# EasyEDA Pro project Tag.epro

# Schematic Schematic3
Board Name: TAG; Create Date: 2025-11-07; Page Name: P1; Project Name: Sansonev2; Schematic Name: Schematic3; Update Date: 2025-11-14; Company: EasyEDA.com; Drawn: Maximo Huykman; Page Size: A4; Reviewed: Maximo Huykman; Version: V1.0
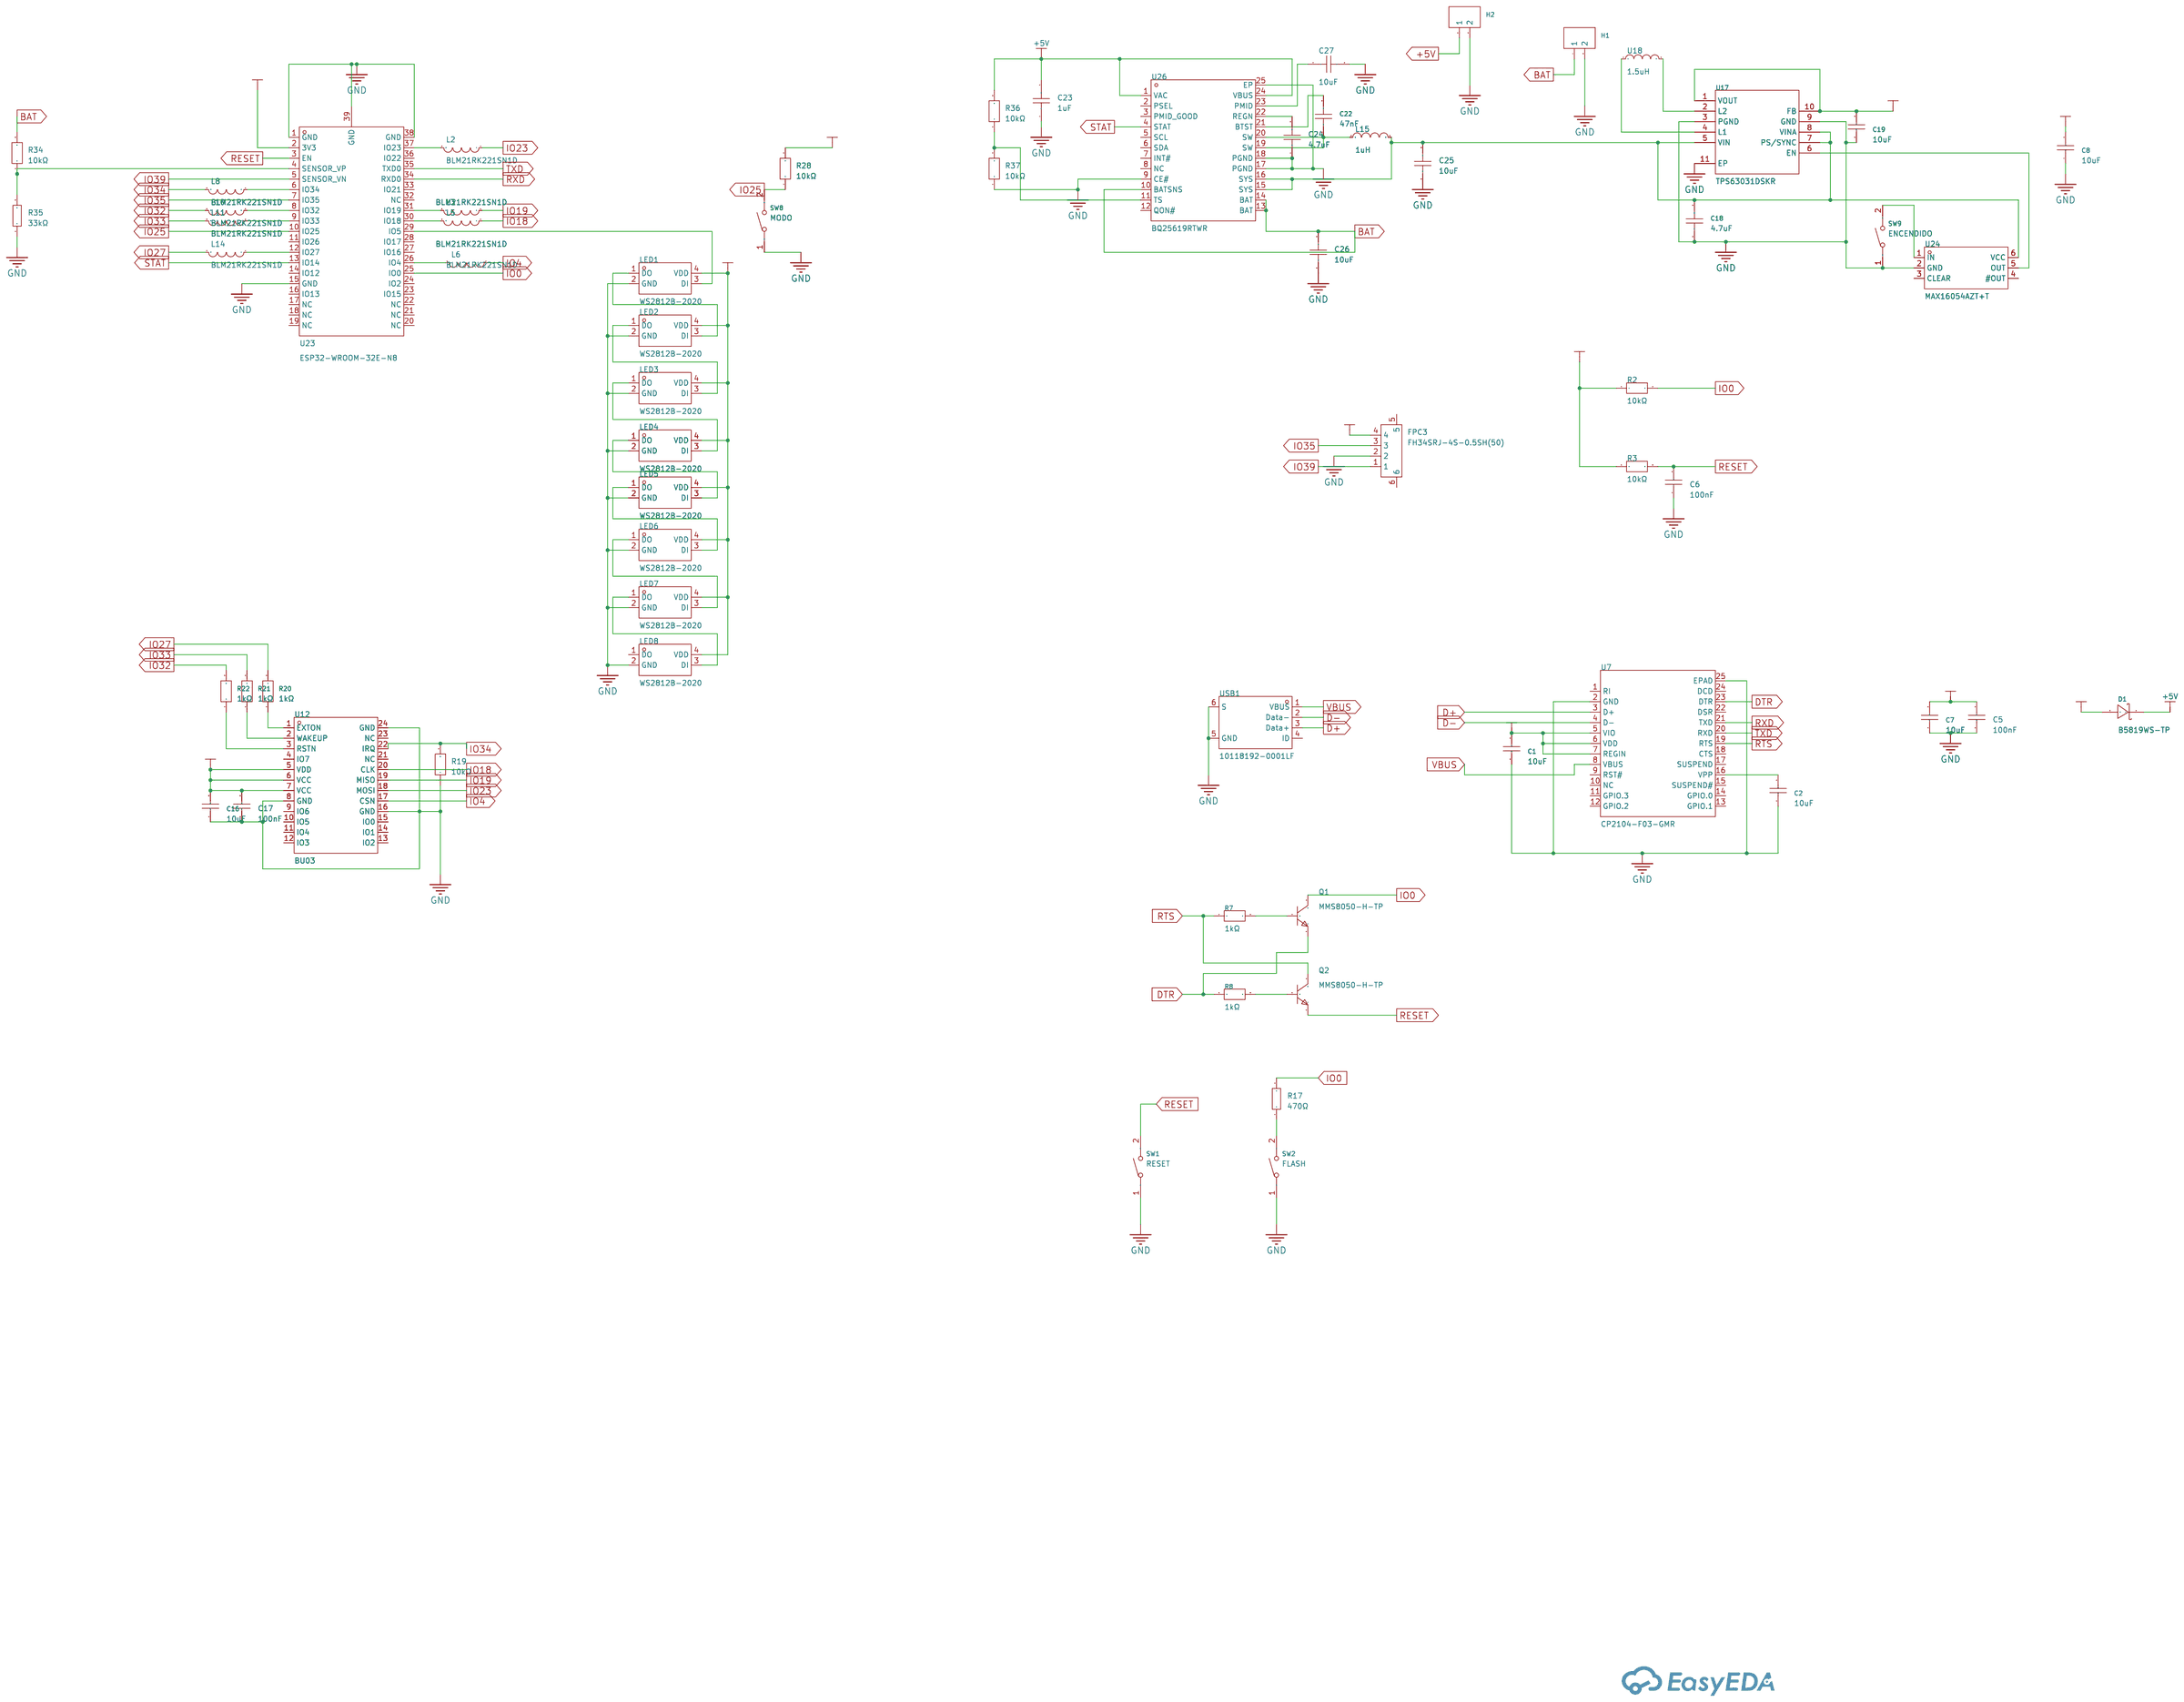
[diagram p0: schematic sheet]

## Parts
C1  10uF  [C0805]
C2  10uF  [C0805]
C5  100nF  [C0805]
C6  100nF  [C0805]
C7  10uF  [C0805]
C8  10uF  [C0805]
C16  10uF  [C0805]
C17  100nF  [C0805]
C18  4.7uF  [C0805]
C19  10uF  [C0805]
C22  47nF  [C0805]
C23  1uF  [C0805]
C24  4.7uF  [C0805]
C25  10uF  [C1206]
C26  10uF  [C1206]
C27  10uF  [C1206]
D1  B5819WS-TP  [SOD-323_L1.8-W1.3-LS2.5-RD]
FPC3  FH34SRJ-4S-0.5SH(50)  [FPC-SMD_FH34SRJ-4S-0.5SH-50]
H1  -  [HDR-TH_2P-P2.54-V-F]
H2  -  [HDR-TH_2P-P2.54-V-F]
L2  BLM21RK221SN1D  [L0805]
L3  BLM21RK221SN1D  [L0805]
L5  BLM21RK221SN1D  [L0805]
L6  BLM21RK221SN1D  [L0805]
L8  BLM21RK221SN1D  [L0805]
L10  BLM21RK221SN1D  [L0805]
L11  BLM21RK221SN1D  [L0805]
L14  BLM21RK221SN1D  [L0805]
L15  1uH  [IND-SMD_L5.4-W5.1]
LED1  WS2812B-2020  [LED-SMD_4P-L2.0-W2.0-TL_WS2812B-2020]
LED2  WS2812B-2020  [LED-SMD_4P-L2.0-W2.0-TL_WS2812B-2020]
LED3  WS2812B-2020  [LED-SMD_4P-L2.0-W2.0-TL_WS2812B-2020]
LED4  WS2812B-2020  [LED-SMD_4P-L2.0-W2.0-TL_WS2812B-2020]
LED5  WS2812B-2020  [LED-SMD_4P-L2.0-W2.0-TL_WS2812B-2020]
LED6  WS2812B-2020  [LED-SMD_4P-L2.0-W2.0-TL_WS2812B-2020]
LED7  WS2812B-2020  [LED-SMD_4P-L2.0-W2.0-TL_WS2812B-2020]
LED8  WS2812B-2020  [LED-SMD_4P-L2.0-W2.0-TL_WS2812B-2020]
Q1  MMS8050-H-TP  [SOT-23-3_L2.9-W1.3-P1.90-LS2.4-BR]
Q2  MMS8050-H-TP  [SOT-23-3_L2.9-W1.3-P1.90-LS2.4-BR]
R2  10kΩ  [R0805]
R3  10kΩ  [R0805]
R7  1kΩ  [R0805]
R8  1kΩ  [R0805]
R17  470Ω  [R0805]
R19  10kΩ  [R0805]
R20  1kΩ  [R0805]
R21  1kΩ  [R0805]
R22  1kΩ  [R0805]
R28  10kΩ  [R0805]
R34  10kΩ  [R0805]
R35  33kΩ  [R0805]
R36  10kΩ  [R0805]
R37  10kΩ  [R0805]
SW1  RESET  [SW-SMD_L3.9-W3.0-P4.45]
SW2  FLASH  [SW-SMD_L3.9-W3.0-P4.45]
SW8  MODO  [SW-SMD_L3.9-W3.0-P4.45]
SW9  ENCENDIDO  [SW-SMD_L3.9-W3.0-P4.45]
U7  CP2104-F03-GMR  [QFN-24_L4.0-W4.0-P0.50-BL-EP2.7]
U12  BU03  [WIRELM-SMD_BU03]
U17  TPS63031DSKR  [SON-10_L2.5-W2.5-P0.50-TL-EP]
U18  1.5uH  [IND-SMD_L2.5-W2.0_MHCHL2520]
U23  ESP32-WROOM-32E-N8  [WIFI-SMD_ESP32-WROOM-32E]
U24  MAX16054AZT+T  [TSOT-23-6_L2.9-W1.6-P0.95-LS2.8-TL]
U26  BQ25619RTWR  [WQFN-24_L4.0-W4.0-P0.50-TL-EP2.7]
USB1  10118192-0001LF  [MICRO-USB-SMD_10118192-0001LF_1]

## Library data of the parts
C1 C2 C7 C8 C16 = CL21A106KPFNNNE: Capacitance: Tolerance:±10% Tolerance:±10% Voltage Rated: Temperature Coefficient:; LCSC Part Name: 10uF ±10% 10V; Supplier Part: C17024; Manufacturer: SAMSUNG(三星); Supplier Footprint: 0805; JLCPCB Part Class: Extended Part; Datasheet: https://atta.szlcsc.com/upload/public/pdf/source/20160218/1457707763339.pdf; Supplier: LCSC; Tolerance: ±10%
C5 C6 C17 = 0805B104J500NT: Capacitance:100nF Tolerance:±5% Tolerance:±5% Voltage Rating:50V Temperature Coefficient:X7R; LCSC Part Name: 100nF ±5% 50V; Supplier Part: C29926; Manufacturer: FH(风华); Supplier Footprint: 0805; JLCPCB Part Class: Extended Part; Datasheet: https://atta.szlcsc.com/upload/public/pdf/source/20200305/C486355_26A10D38EF8C2A5C37091D0039909270.pdf; Supplier: LCSC; Tolerance: ±5%; Voltage Rating: 50V; Temperature Coefficient: X7R
C18 = CC0805KKX7R5BB475: Capacitance: Tolerance:±10% Tolerance:±10% Voltage Rated: Temperature Coefficient:; LCSC Part Name: 4.7uF ±10% 6.3V; Supplier Part: C520073; Manufacturer: YAGEO(国巨); Supplier Footprint: 0805; JLCPCB Part Class: Extended Part; Datasheet: https://atta.szlcsc.com/upload/public/pdf/source/20200423/C520073_92EDCCCC6D91724E446A2BFFC8E332E2.pdf; Supplier: LCSC; Tolerance: ±10%
C19 = GCM21BR70J106KE22L: Capacitance: Tolerance:±10% Tolerance:±10% Voltage Rated: Temperature Coefficient:; LCSC Part Name: 10uF ±10% 6.3V; Supplier Part: C126230; Manufacturer: muRata(村田); Supplier Footprint: 0805; JLCPCB Part Class: Extended Part; Datasheet: https://atta.szlcsc.com/upload/public/pdf/source/20180326/C126230_A7F54E0564564CB583BD3B0CD2F7C89C.pdf; Supplier: LCSC; Tolerance: ±10%
C22 = CC0805JRX7R9BB473: Capacitance:47nF Tolerance:±5% Tolerance:±5% Voltage Rating:50V Temperature Coefficient:X7R; LCSC Part Name: 47nF ±5% 50V; Supplier Part: C326712; Manufacturer: YAGEO(国巨); Supplier Footprint: 0805; JLCPCB Part Class: Extended Part; Datasheet: https://item.szlcsc.com/datasheet/CC0805JRX7R9BB473/306806.html; Supplier: LCSC; Tolerance: ±5%; Voltage Rating: 50V; Temperature Coefficient: X7R
C23 = CC0805JKX7R9BB105: Capacitance: Tolerance:±5% Tolerance:±5% Voltage Rated: Temperature Coefficient:; LCSC Part Name: 1uF ±5% 50V; Supplier Part: C541528; Manufacturer: YAGEO(国巨); Supplier Footprint: 0805; JLCPCB Part Class: Extended Part; Datasheet: https://atta.szlcsc.com/upload/public/pdf/source/20200615/C541528_3316C96F16E83D111D4F7F377579D94B.pdf; Supplier: LCSC; Tolerance: ±5%
C24 = C0805C475J9RACAUTO: Capacitance:4.7uF Tolerance:±5% Tolerance:±5% Voltage Rating:6.3V Temperature Coefficient:X7R; LCSC Part Name: 4.7uF ±5% 6.3V; Supplier Part: C2170670; Manufacturer: KEMET(基美); Supplier Footprint: 0805; JLCPCB Part Class: Extended Part; Datasheet: https://item.szlcsc.com/datasheet/C0805C475J9RACAUTO/2262735.html; Supplier: LCSC; Tolerance: ±5%; Voltage Rating: 6.3V; Temperature Coefficient: X7R
C25-C27 = C1206C106J3RACAUTO: Capacitance: Tolerance:±5% Tolerance:±5% Voltage Rated: Temperature Coefficient:; LCSC Part Name: 10uF ±5% 25V; Supplier Part: C696375; Manufacturer: KEMET(基美); Supplier Footprint: 1206; JLCPCB Part Class: Extended Part; Datasheet: https://atta.szlcsc.com/upload/public/pdf/source/20200618/C599854_9A7AFD29568EF40FC359C8C28B3F53DB.pdf; Supplier: LCSC; Tolerance: ±5%
D1 = B5819WS-TP: Forward Voltage (Vf@If):600mV@1A Reverse Voltage (Vr):40V Average Rectified Current (Io):1A Reverse Leakage Current (Ir):1mA@40V; LCSC Part Name: 电压:40V 电流:1A; Supplier Part: C78734; Manufacturer: MCC(美微科); Supplier Footprint: SOD-323; JLCPCB Part Class: Extended Part; Datasheet: https://atta.szlcsc.com/upload/public/pdf/source/20190308/C78734_7BD7F562D63F05C7B4187010ADA330AA.pdf; Supplier: LCSC; Forward Voltage (Vf@If): 600mV@1A; Reverse Voltage (Vr): 40V; Average Rectified Current (Io): 1A; Reverse Leakage Current (Ir): 1mA@40V
FPC3 = FH34SRJ-4S-0.5SH(50): Locking Feature:- Contact Type:Double-Sided Contacts, Top and Bottom Entry Number of Contacts:4P Pitch:0.5mm Mounting Type:Surface Mount, Right Angle FFC, FCB Thickness:0.3mm FFC, FCB Thickness:0.3mm Height Above Board:1mm Contact Material:Phosphor Bronze; LCSC Part Name: 间距:0.5mm P数:4P 双侧触点/上下接; Supplier Part: C596732; Manufacturer: HRS(广濑); Supplier Footprint: SMD,P=0.5mm,卧贴; JLCPCB Part Class: Extended Part; Datasheet: https://item.szlcsc.com/datasheet/FH34SRJ-4S-0.5SH(50)/625323.html; Supplier: LCSC; Contact Type: Double-Sided Contacts, Top and Bottom Entry; Number of Contacts: 4P; Pitch: 0.5mm; Mounting Type: Surface Mount, Right Angle; FFC, FCB Thickness: 0.3mm; Height Above Board: 1mm; Contact Material: Phosphor Bronze; Contact Plating: Gold; Operating Temperature: -55℃~+105℃
H1 H2 = HDR-F_2.54_1x2P: Supplier Footprint: Through
L2 L3 L5 L6 L8 L10 L11 L14 = BLM21RK221SN1D: Impedance @ Frequency:220Ω@100MHz Tolerance:±25% Tolerance:±25% DC Resistance:200mΩ Current Rating:200mA Circuits:1; LCSC Part Name: 单路 0805磁珠 阻抗220Ω@100MHz; Supplier Part: C710511; Manufacturer: muRata(村田); Supplier Footprint: 0805; JLCPCB Part Class: Extended Part; Datasheet: https://atta.szlcsc.com/upload/public/pdf/source/20210606/F3F13CB7AA6F7BFC37924E68B8587F8A.pdf; Supplier: LCSC; Impedance @ Frequency: 220Ω@100MHz; Tolerance: ±25%; DC Resistance: 200mΩ; Current Rating: 200mA; Circuits: 1
L15 = SLO0520H1R0MTT: Inductance:1uH Tolerance:±20% Tolerance:±20% Current Rating:5A DC Resistance(DCR):15mΩ; LCSC Part Name: 1uH ±20%; Supplier Part: C325980; Manufacturer: Sunltech(顺磁); Supplier Footprint: SMD,5.4x5.1mm; JLCPCB Part Class: Extended Part; Datasheet: https://item.szlcsc.com/datasheet/SLO0520H1R0MTT/306197.html; Supplier: LCSC; Tolerance: ±20%; Current Rating: 5A; DC Resistance(DCR): 15mΩ
LED1-LED8 = WS2812B-2020: Wavelength:515.6nm；622.5nm；470.4nm Luminous Intensity:200mcd；160mcd；520mcd Fixed-Frequency Pwm Mode:- Data Transmission Rate:100KB/S Voltage - Supply:5V Voltage - Supply:5V Quiescent Current:- Lens Color:- ESD Withstand Voltage:- Installation method:op Vi; LCSC Part Name: RGB三色; Supplier Part: C965555; Manufacturer: worldsemi; Supplier Footprint: SMD,2.2x2mm; JLCPCB Part Class: Extended Part; Datasheet: https://item.szlcsc.com/datasheet/WS2812B-2020/1051115.html; Supplier: LCSC; Wavelength: 515.6nm；622.5nm；470.4nm; Luminous Intensity: 200mcd；160mcd；520mcd; Data Transmission Rate: 100KB/S; Voltage - Supply: 5V; Installation method: op View Mount
Q1 Q2 = MMS8050-H-TP: type: Current - Collector(Ic): Collector - Emitter Voltage VCEO: Pd - Power Dissipation: DC Current Gain:120@50mA,1V DC Current Gain:120@50mA,1V Transition frequency(fT):150MHz Current - Collector Cutoff:100nA Vce Saturation(VCE(sat)):600mV Operating Temp; Supplier Part: C668971; Manufacturer: MCC(美微科); Supplier Footprint: SOT-23; JLCPCB Part Class: Extended Part; Datasheet: https://atta.szlcsc.com/upload/public/pdf/source/20200618/C668971_E8C4278A0C61D2294D468F2197C24659.pdf; Supplier: LCSC; DC Current Gain: 120@50mA,1V; Transition frequency(fT): 150MHz; Current - Collector Cutoff: 100nA; Vce Saturation(VCE(sat)): 600mV; Operating Temperature: -55℃~+150℃@(Tj)
R2 R3 R19 R28 R34 R36 R37 = ERJP06F1002V: Type:Thick Film Resistors Resistance:10kΩ Tolerance:±1% Tolerance:±1% Power(Watts): Overload Voltage (Max):- Temperature Coefficient:±100ppm/℃ Temperature Coefficient:±100ppm/℃ Operating Temperature Range:-55℃~+155℃ Operating Temperature Range:-55℃~+155℃; LCSC Part Name: 10kΩ ±1% 500mW 厚膜电阻; Supplier Part: C543567; Manufacturer: PANASONIC(松下); Supplier Footprint: 0805; JLCPCB Part Class: Extended Part; Datasheet: https://atta.szlcsc.com/upload/public/pdf/source/20200515/C543414_D3FB4A44C151AC19BA141503575FC797.pdf; Supplier: LCSC; Type: Thick Film Resistors; Tolerance: ±1%; Temperature Coefficient: ±100ppm/℃; Operating Temperature Range: -55℃~+155℃
R7 R8 R20-R22 = ERJP06F1001V: Type:Thick Film Resistors Resistance:1kΩ Tolerance:±1% Tolerance:±1% Power(Watts): Overload Voltage (Max):- Temperature Coefficient:±100ppm/℃ Temperature Coefficient:±100ppm/℃ Operating Temperature Range:-55℃~+155℃ Operating Temperature Range:-55℃~+155℃; LCSC Part Name: 1kΩ ±1% 500mW 厚膜电阻; Supplier Part: C441981; Manufacturer: PANASONIC(松下); Supplier Footprint: 0805; JLCPCB Part Class: Extended Part; Supplier: LCSC; Type: Thick Film Resistors; Tolerance: ±1%; Temperature Coefficient: ±100ppm/℃; Operating Temperature Range: -55℃~+155℃
R17 = RC0805FR-07470RL: Type:Thick Film Resistors Resistance: Tolerance:±1% Tolerance:±1% Power(Watts): Overload Voltage (Max): Temperature Coefficient:±100ppm/℃ Temperature Coefficient:±100ppm/℃ Operating Temperature Range:-55℃~+155℃ Operating Temperature Range:-55℃~+155℃; LCSC Part Name: 厚膜电阻 470Ω ±1% 125mW; Supplier Part: C114564; Manufacturer: YAGEO(国巨); Supplier Footprint: 0805; JLCPCB Part Class: Extended Part; Datasheet: https://atta.szlcsc.com/upload/public/pdf/source/20180821/C275644_0D56F95EFF785E7D9A1FEF436B37DA78.pdf; Supplier: LCSC; Type: Thick Film Resistors; Tolerance: ±1%; Temperature Coefficient: ±100ppm/℃; Operating Temperature Range: -55℃~+155℃
R35 = RC0805FR-0733KL: Type:Thick Film Resistors Resistance: Tolerance:±1% Tolerance:±1% Power(Watts): Overload Voltage (Max): Temperature Coefficient:±100ppm/℃ Temperature Coefficient:±100ppm/℃ Operating Temperature Range:-55℃~+155℃ Operating Temperature Range:-55℃~+155℃; LCSC Part Name: 厚膜电阻 33kΩ ±1% 125mW; Supplier Part: C141696; Manufacturer: YAGEO(国巨); Supplier Footprint: 0805; JLCPCB Part Class: Extended Part; Datasheet: https://atta.szlcsc.com/upload/public/pdf/source/20180821/C275644_0D56F95EFF785E7D9A1FEF436B37DA78.pdf; Supplier: LCSC; Type: Thick Film Resistors; Tolerance: ±1%; Temperature Coefficient: ±100ppm/℃; Operating Temperature Range: -55℃~+155℃
SW1 SW2 SW8 SW9 = TS-1088-AR02016: Circuit:SPST Actuator Style:Round Button Operating Force:160gf Mounting Style:Brick nogging Switch Length:4mm Switch Width:3mm Switch Height:2mm Strike Gundam:不带 Contact Current:50mA Voltage Rating (DC):12V Insulation Resistance:100MΩ Actuator/Cap Color:B; LCSC Part Name: 4*3*2mm 立贴 轻触开关; Supplier Part: C720477; Manufacturer: XUNPU(讯普); Supplier Footprint: SMD; JLCPCB Part Class: Extended Part; Datasheet: https://atta.szlcsc.com/upload/public/pdf/source/20200810/C720475_60D09DD6C54279ADDB2DC25100F1CC11.pdf; Supplier: LCSC; Circuit: SPST; Actuator Style: Round Button; Operating Force: 160gf; Mounting Style: Brick nogging; Switch Length: 4mm; Switch Width: 3mm; Switch Height: 2mm; Strike Gundam: 不带; Contact Current: 50mA; Voltage Rating (DC): 12V; Insulation Resistance: 100MΩ; Actuator/Cap Color: Black; Pin Style: SMDSplicing; Mechanical Life: 10万次; Operating Temperature: -30℃~+80℃
U7 = CP2104-F03-GMR_C47742: Applications Function:USB to UART Protocol: Supply Voltage:1.8V；3V~3.6V Supply Voltage:1.8V；3V~3.6V Data Rate:2Mbps Operating Temperature:-40℃~+85℃ Operating Temperature:-40℃~+85℃; LCSC Part Name: 单片USB到UART桥接控制器 USB转UART桥接芯片; Supplier Part: C47742; Manufacturer: SKYWORKS/SILICON LABS(芯科); Supplier Footprint: QFN-24-EP(4x4); JLCPCB Part Class: Extended Part; Datasheet: https://atta.szlcsc.com/upload/public/pdf/source/20150504/1457707282429.pdf; Supplier: LCSC; Applications Function: USB to UART; Supply Voltage: 1.8V；3V~3.6V; Data Rate: 2Mbps; Operating Temperature: -40℃~+85℃
U12 = BU03: Supplier Part: C42419011; Manufacturer: Ai-Thinker(安信可); Supplier Footprint: SMD,23x13mm; JLCPCB Part Class: Extended Part; Datasheet: https://atta.szlcsc.com/upload/public/pdf/source/20241223/DD33CB8A3691EFFD799F272BF7523F1A.pdf; Supplier: LCSC
U17 = TPS63031DSKR: Function:Buck-boost type Input Voltage:1.8V~5.5V Input Voltage:1.8V~5.5V Output Voltage:3.3V Output Voltage:3.3V Output Current (Max):900mA Switching Frequency:2.4MHz Synchronous Rectification:Yes Number of Outputs:1 Topology:Step-down-Boost Switch tube (; Supplier Part: C15516; Manufacturer: TI(德州仪器); Supplier Footprint: SON-10-EP(2.5x2.5); JLCPCB Part Class: Extended Part; Datasheet: https://www.ti.com/cn/lit/gpn/tps63031; Supplier: LCSC; Function: Buck-boost type; Input Voltage: 1.8V~5.5V; Output Voltage: 3.3V; Output Current (Max): 900mA; Switching Frequency: 2.4MHz; Synchronous Rectification: Yes; Number of Outputs: 1; Topology: Step-down-Boost; Switch tube (built-in/external): 内置
U18 = SPM2512-1R5M: Inductance: Tolerance:±20% Tolerance:±20% Rated Current: Saturation Current (Isat):4.2A DC Resistance (DCR):; LCSC Part Name: 1.5uH ±20% 4.2A; Supplier Part: C2761859; Manufacturer: KOHERelec(科或); Supplier Footprint: 1008; JLCPCB Part Class: Extended Part; Datasheet: https://atta.szlcsc.com/upload/public/pdf/source/20230823/740E1C79386DCBCE5411E9121BE8F297.pdf; Supplier: LCSC; Tolerance: ±20%; Saturation Current (Isat): 4.2A
U23 = ESP32-WROOM-32E-N8: LCSC Part Name: 通用型Wi-Fi+BT+BLE MCU模组; Supplier Part: C701342; Manufacturer: ESPRESSIF(乐鑫); Supplier Footprint: SMD,18x25.5mm; JLCPCB Part Class: Extended Part; Datasheet: https://atta.szlcsc.com/upload/public/pdf/source/20240307/DEBA00FAE5BA634F0D73085E4F214E93.pdf; Supplier: LCSC
U24 = MAX16054AZT+T: Voltage - Supply:2.7V~5.5V Voltage - Supply:2.7V~5.5V Operating Temperature:-40℃~+125℃ Operating Temperature:-40℃~+125℃; LCSC Part Name: 带去抖动和±15kV ESD保护的开/关控制器; Supplier Part: C79401; Manufacturer: ADI(亚德诺); Supplier Footprint: TSOT-23-6; JLCPCB Part Class: Extended Part; Datasheet: https://atta.szlcsc.com/upload/public/pdf/source/20171230/C79401_15146281019061222139.pdf; Supplier: LCSC; Voltage - Supply: 2.7V~5.5V; Operating Temperature: -40℃~+125℃
U26 = BQ25619RTWR: Supplier Part: C2864534; Manufacturer: TI(德州仪器); Supplier Footprint: WQFN-24-EP(4x4); JLCPCB Part Class: Extended Part; Datasheet: https://www.ti.com/cn/lit/gpn/bq25619; Supplier: LCSC
USB1 = 10118192-0001LF: Connector Type:Micro-B Standard:USB 2.0 Gender:Female Mounting Style:Horizontal attachment Number of Contacts:5P Number of Ports:1 Current Rating - Power (Max):- Operating Temperature Range:-30℃~+80℃ Operating Temperature Range:-30℃~+80℃; LCSC Part Name: Micro-B 母 卧贴; Supplier Part: C132564; Manufacturer: Amphenol; Supplier Footprint: SMD; JLCPCB Part Class: Extended Part; Datasheet: https://atta.szlcsc.com/upload/public/pdf/source/20211129/FE905ED86AF8F92908F94895368BF2E6.pdf; Supplier: LCSC; Connector Type: Micro-B; Standard: USB 2.0; Gender: Female; Mounting Style: Horizontal attachment; Number of Contacts: 5P; Number of Ports: 1; Operating Temperature Range: -30℃~+80℃

## Nets
+3V3: C1.2 C8.2 C16.2 C17.2 C19.2 FPC3.4 LED1.4(VDD) LED2.4(VDD) LED3.4(VDD) LED4.4(VDD) LED5.4(VDD) LED6.4(VDD) LED7.4(VDD) LED8.4(VDD) R2.1 R3.1 R28.2 U7.5(VIO) U7.6(VDD) U7.7(REGIN) U12.5(VDD) U12.6(VCC) U12.7(VCC) U17.1(VOUT) U17.10(FB) U23.2(3V3)
+5V: C23.2 D1.1(K) H2.1 R36.2 U26.1(VAC) U26.24(VBUS)
GND: C1.1 C2.1 C5.1 C6.1 C7.1 C8.1 C16.1 C17.1 C18.1 C19.1 C23.1 C24.1 C25.1 C26.1 C27.2 FPC3.2 H1.2 H2.2 LED1.2(GND) LED2.2(GND) LED3.2(GND) LED4.2(GND) LED5.2(GND) LED6.2(GND) LED7.2(GND) LED8.2(GND) R19.1 R35.1 R37.1 SW1.1 SW2.1 SW8.1 SW9.1 U7.2(GND) U7.25(EPAD) U12.8(GND) U12.16(GND) U12.24(GND) U17.3(PGND) U17.9(GND) U17.11(EP) U23.1(GND) U23.15(GND) U23.38(GND) U23.39(GND) U24.2(GND) U26.9(CE#) U26.17(PGND) U26.18(PGND) U26.25(EP) USB1.5(GND) USB1.6(S)
VBUS: C5.2 C7.2 D1.2(A) U7.8(VBUS) USB1.1(VBUS)
BAT: C26.2 H1.1 R34.2 U26.10(BATSNS) U26.13(BAT) U26.14(BAT)
D+: U7.3(D+) USB1.3(Data+)
D-: U7.4(D-) USB1.2(Data-)
DTR: Q1.2(E) R8.1 U7.23(DTR)
IO0: Q1.3(C) R2.2 R17.2 U23.25(IO0)
IO4: L6.1 U12.17(CSN)
IO18: L5.1 U12.20(CLK)
IO19: L3.1 U12.19(MISO)
IO23: L2.1 U12.18(MOSI)
IO25: R28.1 SW8.2 U23.10(IO25)
IO27: L14.2 R20.2
IO32: L10.2 R22.2
IO33: L11.2 R21.2
IO34: L8.2 R19.2 U12.22(IRQ)
IO35: FPC3.3 U23.7(IO35)
IO39: FPC3.1 U23.5(SENSOR_VN)
RESET: C6.2 Q2.2(E) R3.2 SW1.2 U23.3(EN)
RTS: Q2.3(C) R7.1 U7.19(RTS)
RXD: U7.21(TXD) U23.34(RXD0)
STAT: U23.13(IO14) U26.4(STAT)
TXD: U7.20(RXD) U23.35(TXD0)
$1N3088: L2.2 U23.37(IO23)
$1N3092: L3.2 U23.31(IO19)
$1N3100: L5.2 U23.30(IO18)
$1N3104: L6.2 U23.26(IO4)
$1N3112: L8.1 U23.6(IO34)
$1N3120: L10.1 U23.8(IO32)
$1N3124: L11.1 U23.9(IO33)
$1N3136: L14.1 U23.12(IO27)
$1N4026: R22.1 U12.3(RSTN)
$1N4029: R21.1 U12.2(WAKEUP)
$1N4032: R20.1 U12.1(EXTON)
$1N5123: U17.4(L1) U18.1
$1N5128: U17.2(L2) U18.2
$1N6239: LED1.3(DI) U23.29(IO5)
$1N8822: Q1.1(B) R7.2
$1N8824: Q2.1(B) R8.2
$1N8856: R17.1 SW2.2
$1N8882: C2.2 U7.16(VPP)
$1N23360: R34.1 R35.2 U23.4(SENSOR_VP)
$1N32504: U17.6(EN) U24.5(OUT)
$1N32540: SW9.2 U24.1(IN)
$1N33507: C22.2 U26.21(BTST)
$1N33516: C24.2 U26.22(REGN)
$1N33567: C18.2 C25.2 L15.2 U17.5(VIN) U17.7(PS/SYNC) U17.8(VINA) U24.6(VCC) U26.15(SYS) U26.16(SYS)
$1N33689: C27.1 U26.23(PMID)
$1N33827: C22.1 L15.1 U26.19(SW) U26.20(SW)
$1N37919: LED1.1(DO) LED2.3(DI)
$1N37933: LED2.1(DO) LED3.3(DI)
$1N37942: LED3.1(DO) LED4.3(DI)
$1N37951: LED4.1(DO) LED5.3(DI)
$1N37960: LED5.1(DO) LED6.3(DI)
$1N37969: LED6.1(DO) LED7.3(DI)
$1N37978: LED7.1(DO) LED8.3(DI)
$1N42991: R36.1 R37.2 U26.11(TS)

Not connected (* = marked no-connect by the designer): FPC3 5 6; LED8 1(DO); U7 1(RI) 9(RST#) 10(NC) 11(GPIO.3) 12(GPIO.2) 13(GPIO.1) 14(GPIO.0) 15(SUSPEND#) 17(SUSPEND) 18(CTS) 22(DSR) 24(DCD); U12 4(IO7) 9(IO6) 10(IO5) 11(IO4) 12(IO3) 13(IO2) 14(IO1) 15(IO0) 21(NC) 23(NC); U23 11(IO26) 14(IO12) 16(IO13) 17(NC) 18(NC) 19(NC) 20(NC) 21(NC) 22(NC) 23(IO15) 24(IO2) 27(IO16) 28(IO17) 32(NC) 33(IO21) 36(IO22); U24 3(CLEAR) 4(#OUT); U26 2(PSEL) 3(PMID_GOOD) 5(SCL) 6(SDA) 7(INT#) 8(NC) 12(QON#); USB1 4(ID)

# Board PCB3
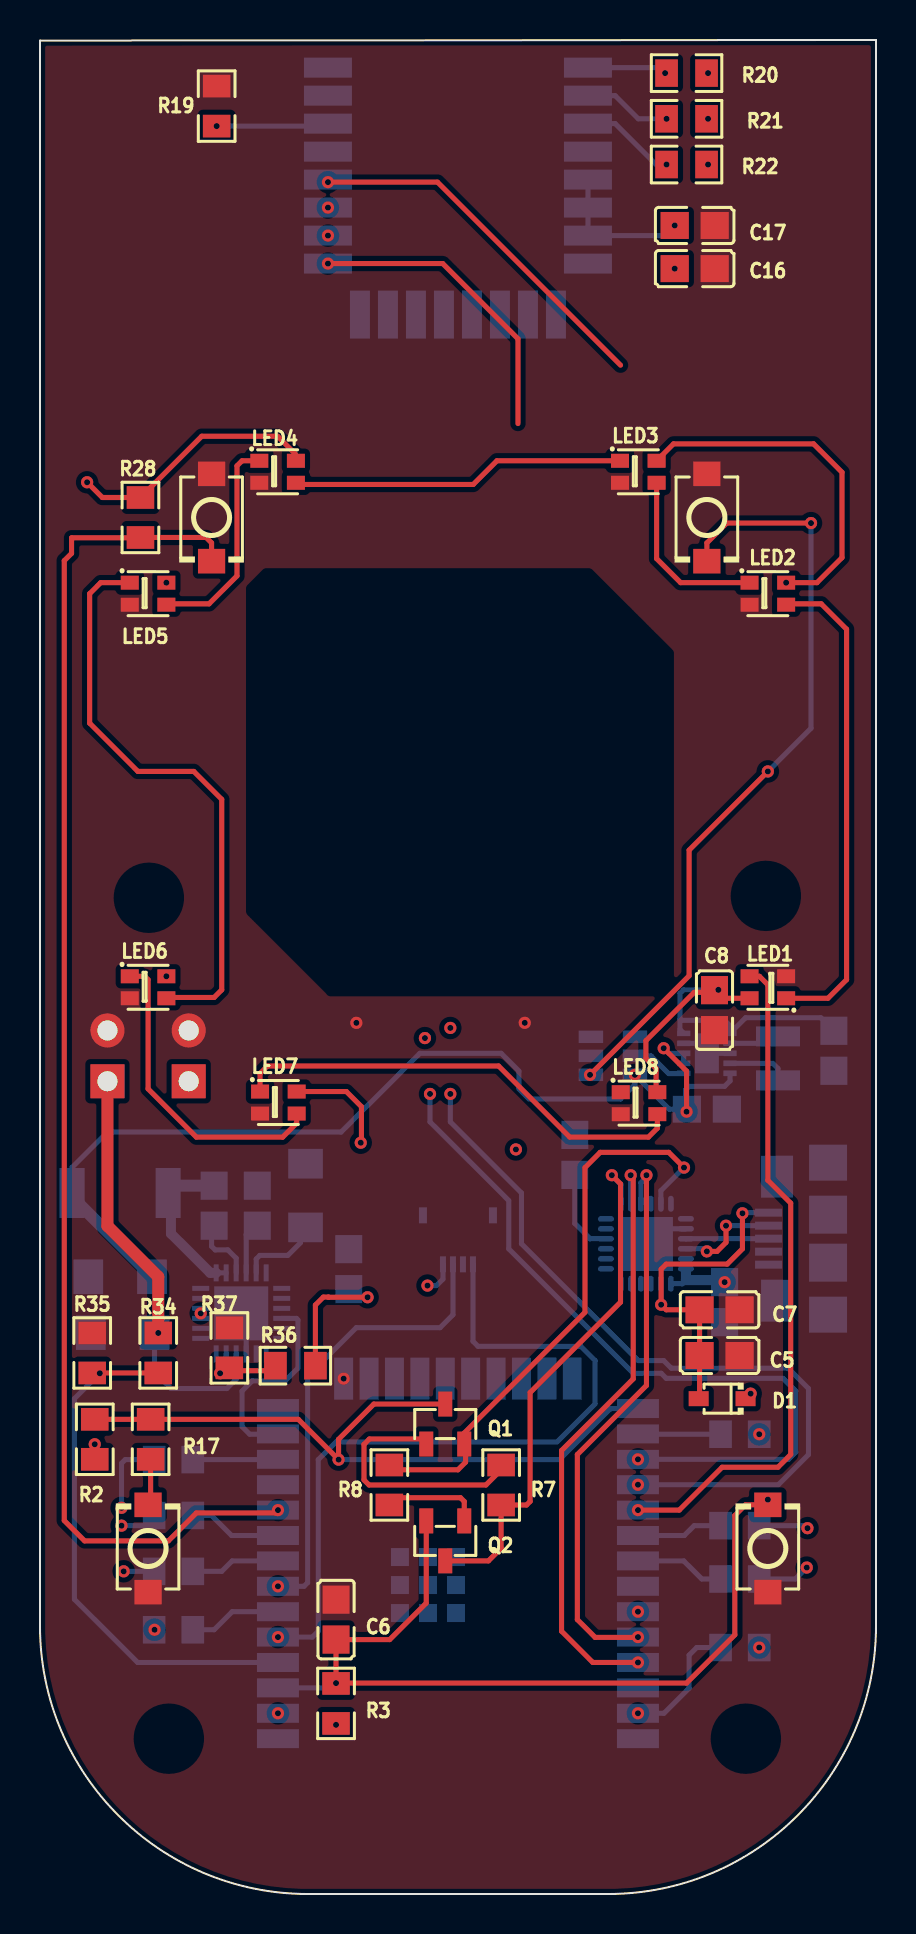
[diagram p1: board, top side]
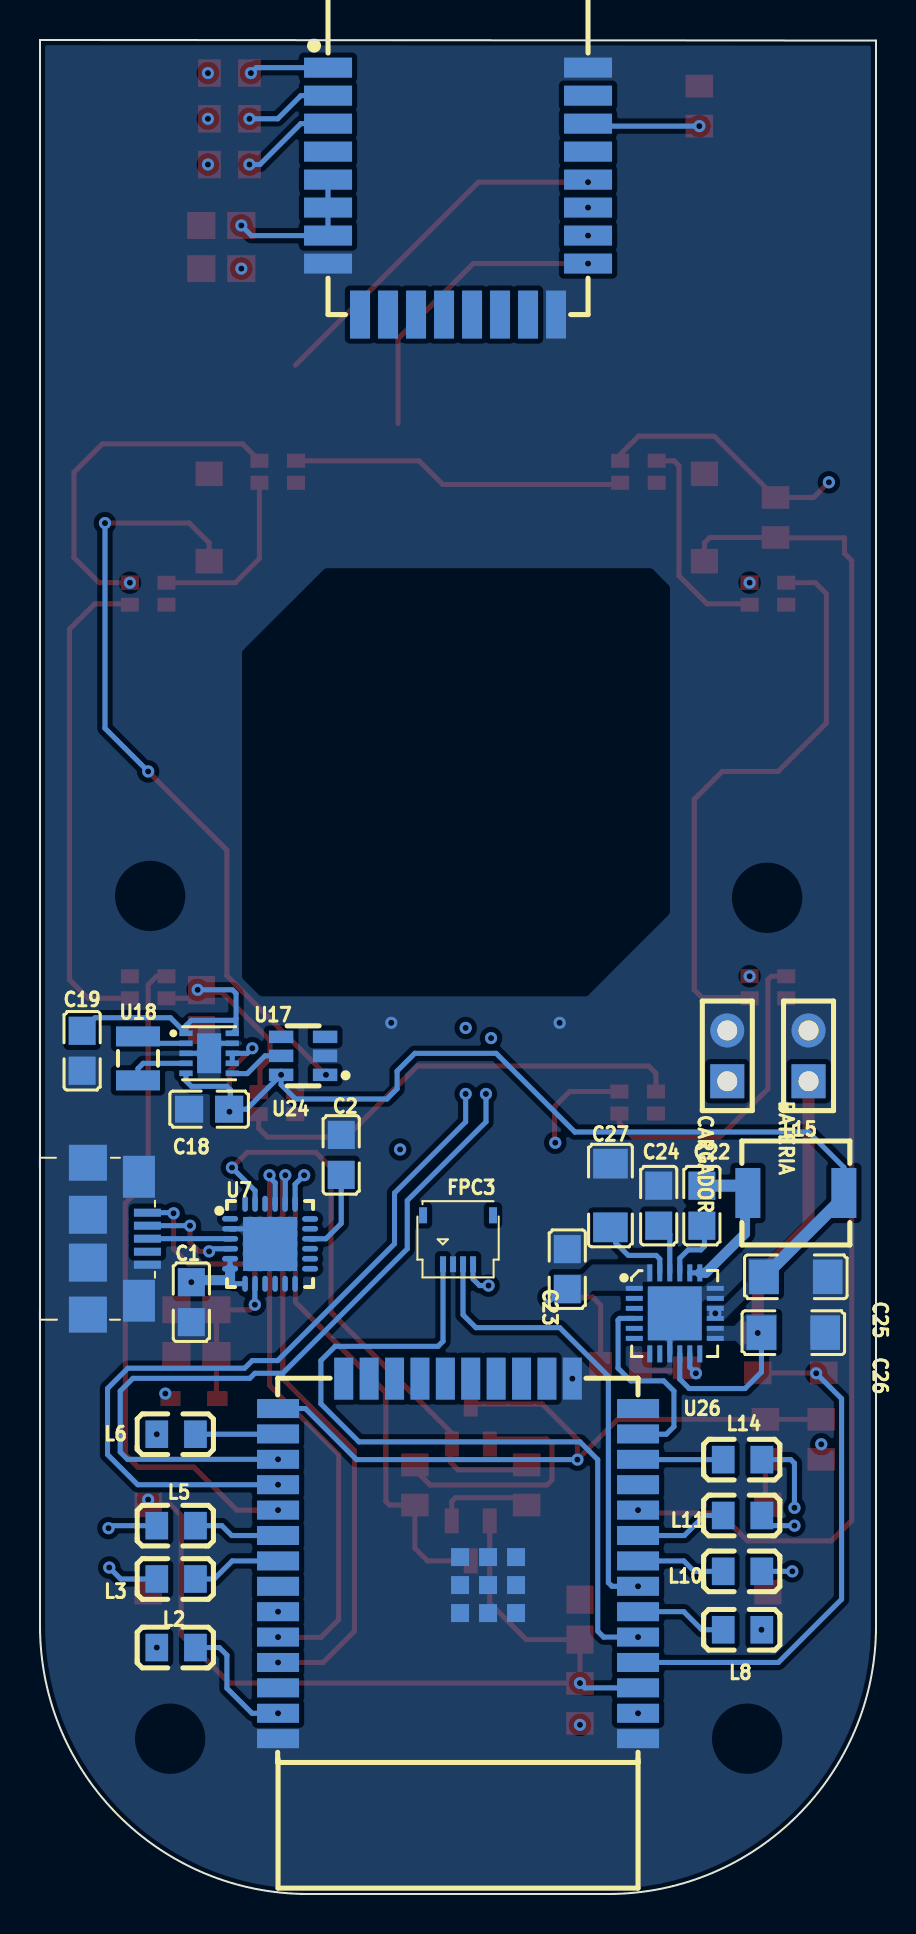
[diagram p2: board, bottom side, seen from below]

Outline 41.8 x 92.72 mm; copper layers: Top Layer, GND, POWER, Bottom Layer. Coordinates in mm from the lower left corner of the outline.
Outline path: 0,92.69 0,13.4 arc(3.92,3.92) 13.4,0 28.4,0 arc(37.88,3.92) 41.8,13.4 41.8,92.72 0,92.69
Stack: Top Layer 0.035mm Outer layer thickness 1oz / Dielectric1 0.2104mm 7628 RC49% 8.6mil / GND 0.0152mm Inner layer thickness / Dielectric2 1.065mm 1.1mm H/HOZ Copper / POWER 0.0152mm Inner layer thickness / Dielectric3 0.2104mm 7628 RC49% 8.6mil / Bottom Layer 0.035mm Outer layer thickness 1oz

## Design rules (mm)
template: Custom Config
spacing copperThickness1oz (default): track to track 0.102, other pairs 0.152 to 0.3
spacing copperThickness2oz: track to track 0.203, other pairs 0.152 to 0.3
track width copperThickness1oz (default): min 0.127, default 0.254, max 2.54
track width copperThickness2oz: min 0.203, default 0.254, max 2.54
differential pair differentialPair (default): width min 0.127, default 0.254, max 2.54; gap min 0.152, default 0.152
via viaSize (default): diameter min 0.5, default 0.61, max 10; hole min 0.3, default 0.305, max 6.3

## Placement (name value [footprint] x y rotation side)
BATERIA  -  [HDR-TH_2P-P2.54-V-F]  3.37 41.92 90 bottom
C1  10uF  [C0805]  34.23 29.6 90 bottom
C2  10uF  [C0805]  26.74 36.96 270 bottom
C5  100nF  [C0805]  33.98 26.93 180 top
C6  100nF  [C0805]  14.8 13.72 270 top
C7  10uF  [C0805]  33.98 29.22 180 top
C8  10uF  [C0805]  33.73 44.2 90 top
C16  10uF  [C0805]  32.73 81.29 180 top
C17  100nF  [C0805]  32.73 83.45 180 top
C18  4.7uF  [C0805]  33.34 39.25 180 bottom
C19  10uF  [C0805]  39.69 42.17 90 bottom
C22  47nF  [C0805]  8.71 34.42 270 bottom
C23  1uF  [C0805]  15.44 31.25 270 bottom
C24  4.7uF  [C0805]  10.87 34.42 270 bottom
C25  10uF  [C1206]  4.01 30.87 0 bottom
C26  10uF  [C1206]  4.13 28.07 0 bottom
C27  10uF  [C1206]  13.28 34.93 90 bottom
CARGADOR  -  [HDR-TH_2P-P2.54-V-F]  7.44 41.92 90 bottom
D1  B5819WS-TP  [SOD-323_L1.8-W1.3-LS2.5-RD]  34.11 24.77 180 top
FPC3  FH34SRJ-4S-0.5SH(50)  [FPC-SMD_FH34SRJ-4S-0.5SH-50]  20.9 32.72 0 bottom
L2  BLM21RK221SN1D  [L0805]  35 12.33 180 bottom
L3  BLM21RK221SN1D  [L0805]  35 15.76 180 bottom
L5  BLM21RK221SN1D  [L0805]  35 18.42 180 bottom
L6  BLM21RK221SN1D  [L0805]  35 22.99 180 bottom
L8  BLM21RK221SN1D  [L0805]  6.67 13.22 180 bottom
L10  BLM21RK221SN1D  [L0805]  6.67 16.14 180 bottom
L11  BLM21RK221SN1D  [L0805]  6.67 18.93 180 bottom
L14  BLM21RK221SN1D  [L0805]  6.67 21.72 180 bottom
L15  1uH  [IND-SMD_L5.4-W5.1]  4.01 35.06 180 bottom
LED1  WS2812B-2020  [LED-SMD_4P-L2.0-W2.0-TL_WS2812B-2020]  36.39 45.35 180 top
LED2  WS2812B-2020  [LED-SMD_4P-L2.0-W2.0-TL_WS2812B-2020]  36.39 65.03 0 top
LED3  WS2812B-2020  [LED-SMD_4P-L2.0-W2.0-TL_WS2812B-2020]  29.92 71.13 0 top
LED4  WS2812B-2020  [LED-SMD_4P-L2.0-W2.0-TL_WS2812B-2020]  11.88 71.13 0 top
LED5  WS2812B-2020  [LED-SMD_4P-L2.0-W2.0-TL_WS2812B-2020]  5.4 65.03 0 top
LED6  WS2812B-2020  [LED-SMD_4P-L2.0-W2.0-TL_WS2812B-2020]  5.4 45.35 0 top
LED7  WS2812B-2020  [LED-SMD_4P-L2.0-W2.0-TL_WS2812B-2020]  11.92 39.58 0 top
LED8  WS2812B-2020  [LED-SMD_4P-L2.0-W2.0-TL_WS2812B-2020]  29.95 39.55 0 top
Q1  MMS8050-H-TP  [SOT-23-3_L2.9-W1.3-P1.90-LS2.4-BR]  20.26 23.5 270 top
Q2  MMS8050-H-TP  [SOT-23-3_L2.9-W1.3-P1.90-LS2.4-BR]  20.26 17.66 90 top
R2  10kΩ  [R0805]  2.74 22.74 90 top
R3  10kΩ  [R0805]  14.8 9.53 90 top
R7  1kΩ  [R0805]  23.06 20.45 90 top
R8  1kΩ  [R0805]  17.47 20.45 270 top
R17  470Ω  [R0805]  5.53 22.74 90 top
R19  10kΩ  [R0805]  8.83 89.42 270 top
R20  1kΩ  [R0805]  32.33 91.07 0 top
R21  1kΩ  [R0805]  32.33 88.78 0 top
R22  1kΩ  [R0805]  32.33 86.49 0 top
R28  10kΩ  [R0805]  5.02 68.84 90 top
R34  10kΩ  [R0805]  5.91 27.06 90 top
R35  33kΩ  [R0805]  2.61 27.06 270 top
R36  10kΩ  [R0805]  12.77 26.42 0 top
R37  10kΩ  [R0805]  9.47 27.31 270 top
SW1  RESET  [SW-SMD_L3.9-W3.0-P4.45]  36.39 17.28 90 top
SW2  FLASH  [SW-SMD_L3.9-W3.0-P4.45]  5.4 17.28 90 top
SW8  MODO  [SW-SMD_L3.9-W3.0-P4.45]  8.58 68.84 270 top
SW9  ENCENDIDO  [SW-SMD_L3.9-W3.0-P4.45]  33.34 68.84 270 top
U7  CP2104-F03-GMR  [QFN-24_L4.0-W4.0-P0.50-BL-EP2.7]  30.3 32.52 270 bottom
U12  BU03  [WIRELM-SMD_BU03]  20.9 85.16 180 bottom
U17  TPS63031DSKR  [SON-10_L2.5-W2.5-P0.50-TL-EP]  33.34 42.04 180 bottom
U18  1.5uH  [IND-SMD_L2.5-W2.0_MHCHL2520]  36.9 41.79 90 bottom
U23  ESP32-WROOM-32E-N8  [WIFI-SMD_ESP32-WROOM-32E]  20.9 16.77 90 bottom
U24  MAX16054AZT+T  [TSOT-23-6_L2.9-W1.6-P0.95-LS2.8-TL]  28.65 41.92 0 bottom
U26  BQ25619RTWR  [WQFN-24_L4.0-W4.0-P0.50-TL-EP2.7]  10.06 29.04 180 bottom
USB1  10118192-0001LF  [MICRO-USB-SMD_10118192-0001LF_1]  37.92 32.77 270 bottom

## Footprints (pads in the part's own frame, mm; a bottom-side part is the same pattern mirrored in y, then rotated)
C0805
  rect 1.41x1.35 smd: 1(-1,0) 2(1,0)
C1206
  rect 1.485x1.728 smd: 1(-1.593,0) 2(1.593,0)
FPC-SMD_FH34SRJ-4S-0.5SH-50
  rect 0.3x0.8 smd: 1(0.75,1.225) 2(0.25,1.225) 3(-0.25,1.225) 4(-0.75,1.225)
  rect 0.4x0.8 smd: 5(-1.75,-1.225) 6(1.75,-1.225)
HDR-TH_2P-P2.54-V-F
  rect 1.7x1.7 hole 1: 1(-1.27,0)
  round 1.7 hole 1: 2(1.27,0)
IND-SMD_L2.5-W2.0_MHCHL2520
  rect 1x2.2 smd: 1(-1.1,0) 2(1.1,0)
IND-SMD_L5.4-W5.1
  rect 1.25x2.5 smd: 1(-2.4,0) 2(2.4,0)
L0805
  rect 1.133x1.377 smd: 1(-0.966,0) 2(0.966,0)
LED-SMD_4P-L2.0-W2.0-TL_WS2812B-2020
  rect 0.9x0.7 smd: 1(-0.915,0.55) 2(-0.915,-0.55) 3(0.915,-0.55) 4(0.915,0.55)
MICRO-USB-SMD_10118192-0001LF_1
  rect 0.4x1.35 smd: 1(-1.3,1.488) 2(-0.65,1.488) 3(0,1.488) 4(0.65,1.488) 5(1.3,1.488)
  rect 1.8x1.9 smd: 6(-3.8,-1.488) 6(3.8,-1.488)
  rect 2.1x1.6 smd: 6(-3.1,1.063) 6(3.1,1.063)
  rect 1.9x1.9 smd: 6(-1.199,-1.488) 6(1.199,-1.488)
QFN-24_L4.0-W4.0-P0.50-BL-EP2.7
  oval 0.28x0.8 smd: 1(-1.25,-2) 2(-0.75,-2) 3(-0.25,-2) 4(0.25,-2) 5(0.75,-2) 6(1.25,-2) 13(1.25,2) 14(0.75,2) 15(0.25,2) 16(-0.25,2) 17(-0.75,2) 18(-1.242,2)
  oval 0.8x0.28 smd: 7(2,-1.25) 8(2,-0.75) 9(2,-0.25) 10(2,0.25) 11(2,0.75) 12(2,1.25) 19(-2,1.25) 20(-2,0.75) 21(-2,0.25) 22(-2,-0.25) 23(-2,-0.75) 24(-2,-1.25)
  rect 2.7x2.7 smd: 25(0.013,0)
R0805
  rect 1.133x1.377 smd: 1(-1,0) 2(1,0)
SOD-323_L1.8-W1.3-LS2.5-RD
  rect 1x0.75 smd: 1(-1.173,0) 2(1.173,0)
SON-10_L2.5-W2.5-P0.50-TL-EP
  rect 0.665x0.28 smd: 1(-1.157,1) 2(-1.157,0.5) 3(-1.157,0) 4(-1.157,-0.5) 5(-1.157,-1) 6(1.157,-1) 7(1.157,-0.5) 8(1.157,0) 9(1.157,0.5) 10(1.157,1)
  rect 1.2x2 smd: 11(0,0)
SOT-23-3_L2.9-W1.3-P1.90-LS2.4-BR
  rect 1.25x0.7 smd: 1(1,-0.95) 2(1,0.95) 3(-1,0)
SW-SMD_L3.9-W3.0-P4.45
  rect 1.23x1.36 smd: 1(-2.185,0) 2(2.185,0)
TSOT-23-6_L2.9-W1.6-P0.95-LS2.8-TL
  rect 1.219x0.623 smd: 1(-1.1,0.95) 2(-1.1,0) 3(-1.1,-0.95) 4(1.1,-0.95) 5(1.1,0) 6(1.1,0.95)
WIFI-SMD_ESP32-WROOM-32E
  rect 0.95x2.1 smd: 1(-9.002,-9) 2(-7.732,-9) 3(-6.463,-9) 4(-5.192,-9) 5(-3.922,-9) 6(-2.652,-9) 7(-1.383,-9) 8(-0.113,-9) 9(1.157,-9) 10(2.428,-9) 11(3.697,-9) 12(4.968,-9) 13(6.237,-9) 14(7.508,-9) 25(7.508,9) 26(6.237,9) 27(4.968,9) 28(3.697,9) 29(2.428,9) 30(1.157,9) 31(-0.113,9) 32(-1.383,9) 33(-2.652,9) 34(-3.922,9) 35(-5.192,9) 36(-6.463,9) 37(-7.732,9) 38(-9.002,9)
  rect 2.1x0.95 smd: 15(9.002,-5.715) 16(9.002,-4.445) 17(9.002,-3.175) 18(9.002,-1.905) 19(9.002,-0.635) 20(9.002,0.635) 21(9.002,1.905) 22(9.002,3.175) 23(9.002,4.445) 24(9.002,5.715)
  rect 0.9x0.9 smd: 39(-2.721,-2.9) 39(-2.721,-1.5) 39(-2.721,-0.1) 39(-1.321,-2.9) 39(-1.321,-1.5) 39(-1.321,-0.1) 39(0.079,-2.9) 39(0.079,-1.5) 39(0.079,-0.1)
WIRELM-SMD_BU03
  rect 2.4x1 smd: 1(-6.5,6.175) 2(-6.5,4.775) 3(-6.5,3.375) 4(-6.5,1.975) 5(-6.5,0.575) 6(-6.5,-0.825) 7(-6.5,-2.225) 8(-6.5,-3.625) 17(6.5,-3.625) 18(6.5,-2.225) 19(6.5,-0.825) 20(6.5,0.575) 21(6.5,1.975) 22(6.5,3.375) 23(6.5,4.775) 24(6.5,6.175)
  rect 1x2.4 smd: 9(-4.9,-6.175) 10(-3.5,-6.175) 11(-2.1,-6.175) 12(-0.7,-6.175) 13(0.7,-6.175) 14(2.1,-6.175) 15(3.5,-6.175) 16(4.9,-6.175)
WQFN-24_L4.0-W4.0-P0.50-TL-EP2.7
  rect 0.85x0.25 smd: 1(-2.025,1.25) 2(-2.025,0.75) 3(-2.025,0.25) 4(-2.025,-0.25) 5(-2.025,-0.75) 6(-2.025,-1.25) 13(2.025,-1.25) 14(2.025,-0.75) 15(2.025,-0.25) 16(2.025,0.25) 17(2.025,0.75) 18(2.025,1.25)
  rect 0.25x0.85 smd: 7(-1.25,-2.025) 8(-0.75,-2.025) 9(-0.25,-2.025) 10(0.25,-2.025) 11(0.75,-2.025) 12(1.25,-2.025) 19(1.25,2.025) 20(0.75,2.025) 21(0.25,2.025) 22(-0.25,2.025) 23(-0.75,2.025) 24(-1.25,2.025)
  rect 2.7x2.7 smd: 25(0.001,0)

## Nets
As in the schematic, except:
+5V: C23.2 CARGADOR.1 D1.1 R36.2 U26.1 U26.24
GND: BATERIA.2 C1.1 C2.1 C5.1 C6.1 C7.1 C8.1 C16.1 C17.1 C18.1 C19.1 C23.1 C24.1 C25.1 C26.1 C27.2 CARGADOR.2 FPC3.2 LED1.2 LED2.2 LED3.2 LED4.2 LED5.2 LED6.2 LED7.2 LED8.2 R19.1 R35.1 R37.1 SW1.1 SW2.1 SW8.1 SW9.1 U7.2 U7.25 U12.8 U12.16 U12.24 U17.3 U17.9 U17.11 U23.1 U23.15 U23.38 U23.39 U24.2 U26.9 U26.17 U26.18 U26.25 USB1.5 USB1.6
BAT: BATERIA.1 C26.2 R34.2 U26.10 U26.13 U26.14

Pads without a net: FPC3 5 6; LED8 1; U7 1 9 10 11 12 13 14 15 17 18 22 24; U12 4 9 10 11 12 13 14 15 21 23; U23 11 14 16 17 18 19 20 21 22 23 24 27 28 32 33 36; U24 3 4; U26 2 3 5 6 7 8 12; USB1 4

## Via types
v1: diameter 0.61, hole 0.305, Top Layer to Bottom Layer, 73 vias

## Routing (per net, layer and track width the routed paths; a pad name or vN(x,y) marks a point on that pad's centre or on a via; arc(x,y) is an arc through that point)
+3V3: length 71.3
  Top Layer w0.254: LED8.4 30.8,40.16 30.8,41.28 30.3,41.79 30.3,42.68 32.71,45.09 33.79,45.09 v1(33.92,45.22) 34.34,44.8 LED1.4 ; v1(16.04,37.57) 16.07,37.61 16.07,39.38 15.32,40.13 LED7.4 ; 12.77,72.02 11.88,72.91 8.09,72.91 R28.2 3.12,69.84 v1(2.36,70.6) ; v1(37.31,65.58) 38.85,65.58 40.1,66.84 40.1,71.1 38.68,72.52 31.68,72.52 LED3.4 ; v1(2.74,22.49) R2.1
  Bottom Layer w0.254: v1(31.73,83.45) 31.23,82.94 U12.7 U12.6 U12.5 ; 32.3,30.7 32.12,30.52 U7.7 ; v1(19.37,30.43) 19.82,30.43 20.15,30.75 FPC3.4 ; U7.5 U7.6 ; v1(33.92,45.22) 32.18,45.22 32,45.04 32,43.77 ; 32,43.77 32.07,43.7 34.23,43.7 34.5,43.43 U17.1 35.28,43.82 39.04,43.82 C19.2 ; 32,43.77 32,43.23 U17.10
  Bottom Layer w0.5: U7.6 32.3,30.7 34.13,30.7 v1(34.23,30.6)
  vias: v1(6.32,65.58) v1(6.32,45.9) v1(11.9,9.04) v1(14.8,8.46) v1(23.8,37.24) v1(31.73,81.29)
+5V: length 44.5
  Top Layer w0.254: v1(16.38,29.84) 14.43,29.84 14.42,29.85 14.17,29.85 13.77,29.46 R36.2
  POWER w0.5: v1(35.53,25.03) 34.06,26.5 18.03,26.5 17.85,26.68 17.85,28.37 v1(16.38,29.84) 13.29,29.84 8.96,34.17 8.96,39.5 7.82,40.65 CARGADOR.1
GND: length 7
  Bottom Layer w0.254: U26.25 10.31,28.79 U26.9 ; U7.2 31.06,33.27 U7.25 ; U17.9 32.84,42.54 U17.11 U17.3
  vias: v1(15.18,25.77) v1(15.82,43.57) v1(24.24,43.57)
VBUS: length 17
  Top Layer w0.254: v1(35.12,34.04) 35.12,32.27 34.36,31.5 31.31,31.5 31.06,31.25 v1(31.06,29.47) 31.31,29.22 C7.2 C5.2 32.98,24.95 32.81,24.77
  Bottom Layer w0.254: v1(31.06,29.47) 31.06,30.51 U7.8 ; USB1.1 35.15,34.07 v1(35.12,34.04)
(no net): length 82.7
  GND w0.254: v1(19.25,42.81) 19.5,42.55 v1(19.5,40.01) ; v1(20.52,40.01) v1(20.52,43.31)
  Bottom Layer w0.254: v1(20.52,40.01) 20.52,38.62 24.07,35.06 24.07,32.52 29.92,26.68 31.19,26.68 31.57,26.3 37.41,26.3 38.42,25.28 38.42,21.98 36.91,20.47 v1(29.9,20.47) ; v1(29.9,21.74) 37.42,21.74 37.79,22.11 37.79,25.15 37.15,25.79 31.31,25.79 31.06,26.04 29.66,26.04 23.44,32.27 23.44,34.68 19.5,38.62 v1(19.5,40.01)
  vias: v1(29.9,14.12)
BAT: length 21.5
  Top Layer w0.6: BATERIA.1 3.37,33.41 5.91,30.87 v1(5.91,28.06)
  Bottom Layer w0.254: C26.2 5.73,26.1 6.55,25.28 9.34,25.28 9.81,25.75 U26.10
D+: length 4
  Bottom Layer w0.254: U7.3 32.3,32.77 36.3,32.77
D-: length 5.2
  Top Layer w0.254: v1(33.34,32.14) 33.85,32.14 34.3,32.59 v1(34.3,33.42)
  Bottom Layer w0.254: v1(33.34,32.14) 33.21,32.27 U7.4 ; USB1.2 v1(34.3,33.42)
DTR: length 29.2
  Top Layer w0.254: R8.1 17.71,21.22 20.9,21.22 21.28,21.6 21.28,22.44 Q1.2 21.21,23.06 27.25,29.09 27.25,36.33 28.01,37.09 31.44,37.09 v1(32.2,36.33)
  Bottom Layer w0.254: v1(32.2,36.33) 31.05,35.17 U7.23
IO0: length 36.1
  Top Layer w0.254: R2.2 R17.2 12.91,23.74 v1(14.93,21.72) 14.93,22.74 16.69,24.5 Q1.3
  Bottom Layer w0.254: U23.25 28.53,24.28 25.98,21.72 v1(14.93,21.72)
IO4: length 124.6
  Top Layer w0.254: v1(14.4,81.54) 14.4,81.54 20.14,81.54 23.9,77.78 23.9,73.54
  GND w0.254: v1(14.4,81.54) 14,81.14 14,71.09 9.72,66.81 9.72,45.73 14,41.45 14,30.07 3.49,19.56 3.49,16 3.94,15.55 4.43,15.55 11.87,22.99 v1(35.96,22.99)
IO18: length 139.4
  Top Layer w0.254: v1(14.4,85.61) 19.88,85.61 29.03,76.46
  GND w0.254: v1(14.4,85.61) 11.03,82.25 11.03,71.42 7.82,68.21 7.82,45.17 10.34,42.64 10.34,29.28 2.43,21.36 2.43,15.56 3.5,14.48 4.87,14.48 5.84,15.45 9.69,15.45 10.4,14.74 38.42,14.74 39.31,15.63 39.31,17.36 v1(38.37,18.3)
  Bottom Layer w0.254: L5.1 38.25,18.42 v1(38.37,18.3)
IO19: length 114.7
  GND w0.254: v1(38.34,16.33) 38.27,16.39 6.27,16.39 4.72,14.84 3.65,14.84 2.78,15.71 2.78,21.21 10.99,29.42 10.99,42.68 8.45,45.22 8.45,67.83 12.02,71.4 12.02,81.96 v1(14.4,84.34)
  Bottom Layer w0.254: v1(38.34,16.33) 37.77,15.76 L3.1
IO23: length 125.8
  GND w0.254: v1(14.4,82.94) 13.01,81.55 13.01,71.24 9.09,67.32 9.09,45.47 11.75,42.81 11.75,29.68 3.14,21.06 3.14,15.85 3.79,15.2 4.57,15.2 11.86,22.49 34.11,22.49 36.27,20.33 38.81,20.33 40.08,19.06 40.08,13.47 38.93,12.33 v1(35.96,12.33)
IO25: length 69.1
  Top Layer w0.254: v1(11.9,19.2) 11.76,19.06 7.82,19.06 6.42,17.66 2.23,17.66 1.21,18.68 1.21,66.68 1.58,67.05 1.58,67.83 5.01,67.83 R28.1 8.31,67.84 8.58,67.57 SW8.2
IO27: length 93.2
  GND w0.254: v1(4.08,19.31) 4.39,19.31 27.38,42.3 29.28,42.3 32.07,45.09 32.07,65.92 28.09,69.9 28.09,87.08 32.08,91.07 v1(33.4,91.07)
  Bottom Layer w0.254: v1(4.08,19.31) 4.08,21.54 4.26,21.72 L14.2
IO32: length 85.4
  GND w0.254: v1(33.4,86.49) 33.22,86.31 33.22,42.72 13.85,23.35 11.72,23.35 4.51,16.14 v1(4.18,16.14)
  Bottom Layer w0.254: L10.2 v1(4.18,16.14)
IO33: length 89.1
  GND w0.254: v1(4.08,18.42) 5.18,18.42 16.02,29.26 16.62,29.26 16.96,29.6 16.96,31.05 19.13,33.21 19.62,33.21 23.05,36.65 24.61,36.65 32.58,44.63 32.58,67.19 30.38,69.39 30.38,87 32.15,88.78 v1(33.4,88.78)
  Bottom Layer w0.254: v1(4.08,18.42) 5.2,18.42 L11.2
IO34: length 86.2
  GND w0.254: v1(8.83,88.42) 5.21,84.79 5.21,53.94 2.07,50.8 2.07,15.41 3.38,14.1 5.21,14.1 5.73,13.58 v1(5.73,13.22)
  Bottom Layer w0.254: U12.22 14.27,88.42 v1(8.83,88.42)
IO35: length 22.9
  Bottom Layer w0.254: v1(11.9,15.39) 13.2,15.39 13.38,15.57 13.38,25.89 15.81,28.32 20,28.32 20.65,28.97 FPC3.3
IO39: length 38.2
  Bottom Layer w0.254: v1(11.9,12.85) 13.62,12.85 13.91,13.15 13.91,21.72 14.8,22.61 25.85,22.61 27.76,24.52 27.76,26.68 27.04,27.39 21.9,27.39 21.65,27.64 FPC3.1
RESET: length 43.3
  Top Layer w0.254: Q2.2 19.31,14.55 17.49,12.72 C6.2 v1(14.8,10.55) 32.33,10.55 34.74,12.96 34.74,18.93 35.28,19.46 SW1.2
  Bottom Layer w0.254: v1(14.8,10.55) 14.56,10.31 U23.3
  vias: v1(36.39,19.73)
RTS: length 26.7
  Top Layer w0.254: v1(28.59,35.95) 29.03,35.51 29.03,29.6 24.51,25.08 24.51,19.63 24.33,19.45 R7.1 23.06,17.3 22.42,16.66 Q2.3
  Bottom Layer w0.254: U7.19 29.05,35.49 v1(28.59,35.95)
RXD: length 28.7
  Top Layer w0.254: 29.92,12.71 29.79,12.83 27.76,12.83 26.87,13.72 26.87,21.98 30.32,25.43 v1(30.32,35.95)
  Bottom Layer w0.254: v1(30.32,35.95) 30.32,35.85 30.04,35.57 30.04,34.52 U7.21
  vias: v1(29.9,12.85)
STAT: length 10.3
  Bottom Layer w0.254: U26.4 12.82,28.79 12.9,28.71 12.9,26.3 12.26,25.66 10.61,25.66 10.1,25.15 10.1,23.38 10.48,22.99 11.88,22.99 U23.13
TXD: length 30.2
  Top Layer w0.254: v1(29.9,11.58) 27.64,11.58 26.08,13.14 26.08,22.18 29.66,25.76 29.66,35.82 v1(29.53,35.95)
  Bottom Layer w0.254: v1(29.53,35.95) 29.53,34.53 U7.20
$1N3088: length 6.5
  Bottom Layer w0.254: L2.2 32.84,12.33 32.46,11.95 32.46,10.29 31.2,9.04 v1(29.9,9.04)
$1N3092: length 4.5
  Bottom Layer w0.254: L3.2 33.09,15.76 32.19,16.66 U23.31
$1N3100: length 4.3
  Bottom Layer w0.254: L5.2 32.71,18.42 32.22,17.93 U23.30
$1N3104: length 4.1
  Bottom Layer w0.254: U23.26 29.91,22.99 L6.2
$1N3112: length 4.6
  Bottom Layer w0.254: U23.6 9.61,14.12 8.71,13.22 L8.1
$1N3120: length 4.5
  Bottom Layer w0.254: L10.1 9.09,16.14 9.61,16.66 U23.8
$1N3124: length 4.7
  Bottom Layer w0.254: U23.9 9.58,17.93 8.58,18.93 L11.1
$1N3136: length 4.3
  Bottom Layer w0.254: U23.12 11.88,21.72 L14.1
$1N4026: length 4.8
  Bottom Layer w0.254: U12.3 28.76,88.54 30.8,86.49 v1(31.33,86.49)
$1N4029: length 4.4
  Bottom Layer w0.254: U12.2 28.76,89.94 29.92,88.78 v1(31.33,88.78)
$1N4032: length 4
  Bottom Layer w0.254: v1(31.26,91.07) 30.98,91.34 U12.1
$1N5123: length 3.1
  Bottom Layer w0.254: U18.1 36.9,41.28 36.64,41.54 U17.4
$1N5128: length 2.5
  Bottom Layer w0.254: U17.2 36.55,42.54 U18.2
$1N6239: length 33.8
  Top Layer w0.254: LED1.3 35.97,45.9 36.39,45.47 36.39,35.69 37.54,34.55 37.54,21.98 36.9,21.34 34.11,21.34 31.96,19.2 v1(29.9,19.2)
$1N8822: length 12.6
  Top Layer w0.254: R7.2 23.06,21.22 22.3,20.45 16.45,20.45 16.2,20.71 16.2,22.49 16.47,22.76 19.06,22.76 Q1.1
$1N8824: length 4.9
  Top Layer w0.254: R8.2 17.83,19.82 21.03,19.82 21.21,19.63 Q2.1
$1N8856: length 2.3
  Top Layer w0.254: R17.1 5.53,19.59 SW2.2
$1N8882: length 4.3
  Bottom Layer w0.254: C2.2 26.74,33.54 27.51,32.77 U7.16
$1N23360: length 26.6
  Top Layer w0.254: R35.2 R34.1
  Bottom Layer w0.254: v1(2.99,26.04) 1.72,24.77 1.72,14.74 4.88,11.58 U23.4
$1N32504: length 2.8
  Bottom Layer w0.254: U17.6 32.17,41.03 31.44,41.03 30.55,41.92 U24.5
$1N32540: length 38.7
  Top Layer w0.254: v1(38.55,68.56) 34.33,68.56 33.34,67.57 SW9.2 ; v1(27.5,40.97) 32.46,45.92 32.46,52.2 v1(36.39,56.14)
  Bottom Layer w0.254: v1(38.55,68.56) 38.55,58.3 v1(36.39,56.14)
$1N33507: length 3.3
  Bottom Layer w0.254: U26.21 9.81,31.8 9.39,32.21 8.76,32.21 8.58,32.39 8.58,33.3 8.45,33.42
$1N33516: length 2.5
  Bottom Layer w0.254: 10.61,33.42 10.61,33.3 10.31,33 U26.22
$1N33567: length 52.2
  Top Layer w0.254: v1(32.33,39.12) 32.33,41.16 v1(31.19,42.3)
  Bottom Layer w0.254: U17.7 U17.8 31.44,42.04 v1(31.19,42.3) ; L15.2 1.61,36.34 3.37,38.11 15.06,38.11 18.99,42.04 23.06,42.04 23.95,41.16 23.95,40.27 24.45,39.76 29.03,39.76 29.75,40.48 v1(29.75,40.97) 31.46,39.25 C18.2 32.28,39.32 32.28,40.21 32.46,40.39 34.23,40.39 34.5,40.66 U17.5
  Bottom Layer w0.6: L15.2 1.61,34.86 C25.2
  vias: v1(8.04,29.04)
$1N33689: length 4
  Bottom Layer w0.254: 13.02,33.34 13.02,32.57 12.39,31.94 10.99,31.94 10.81,31.76 U26.23
$1N33827: length 7.9
  Bottom Layer w0.254: U26.19 U26.20
  Bottom Layer w0.5: L15.1 6.55,34.92 6.55,33.03 8.51,31.06 U26.19
  Bottom Layer w0.6: L15.1 6.77,35.42 8.45,35.42
$1N37919: length 24.5
  Top Layer w0.254: LED2.3 37.56,64.48 37.6,64.52 39.06,64.52 40.33,63.25 40.33,45.73 39.4,44.8 LED1.1
$1N37933: length 8.9
  Top Layer w0.254: LED2.1 32.03,65.58 30.83,66.78 LED3.3
$1N37942: length 16.7
  Top Layer w0.254: LED4.3 12.88,70.49 21.66,70.49 22.84,71.68 29,71.68
$1N37951: length 10.9
  Top Layer w0.254: LED4.1 10.1,71.68 9.85,71.42 9.85,65.92 8.45,64.52 6.36,64.52 LED5.3
$1N37960: length 29.4
  Top Layer w0.254: LED5.1 3.03,65.58 2.48,65.03 2.48,58.55 4.9,56.14 7.69,56.14 9.09,54.74 9.09,45.22 8.71,44.84 6.36,44.84 LED6.3
$1N37969: length 15.6
  Top Layer w0.254: LED6.1 5.24,45.9 5.4,45.73 5.4,40.27 7.82,37.85 12.14,37.85 12.83,38.55 LED7.3
$1N37978: length 23.3
  Top Layer w0.254: LED7.1 11,41.04 11.37,41.41 22.93,41.41 26.49,37.85 30.42,37.85 30.87,38.3 LED8.3
$1N42991: length 3.7
  Top Layer w0.254: R37.2 9.61,26.17 11.75,26.17 11.77,26.19 ; 11.77,26.19 11.77,26.17 ; 11.77,26.19 11.95,26.37
  Bottom Layer w0.254: U26.11 9.31,26.35 v1(9.01,26.04)

## Copper pours and planes (outline as drawn; the poured copper is in the pictures)
+3V3 on POWER: 0,92.69 41.85,92.69 41.85,0.13 0,0.13
+5V on Bottom Layer: 11.3,31.49 16.1,31.49 16.1,29.54 11.3,29.54
GND on Top Layer: 0,92.69 41.85,92.69 41.85,0.13 0,0.13
GND on Bottom Layer: 0,92.69 41.85,92.69 41.85,0.13 0,0.13
GND on GND: 0,93.07 41.85,93.07 41.85,0.52 0,0.52
BAT on Bottom Layer: 4.95,29.01 8.46,29.01 8.46,27.19 4.95,27.19
$1N33567 on Bottom Layer: 4.9,31.81 8.46,31.81 8.46,28.66 4.9,28.66
